# Altium schematic sheet Project_Information.SchDoc: =project_title
size Tabloid; CompanyName: Luxonis Holding; Organization: Luxonis Holding; Address1: 1925 Harmony Park Drive; Address2: Westminster, CO; Address3: 80234; Address4: United States; SheetNumber: 1; SheetTotal: 3
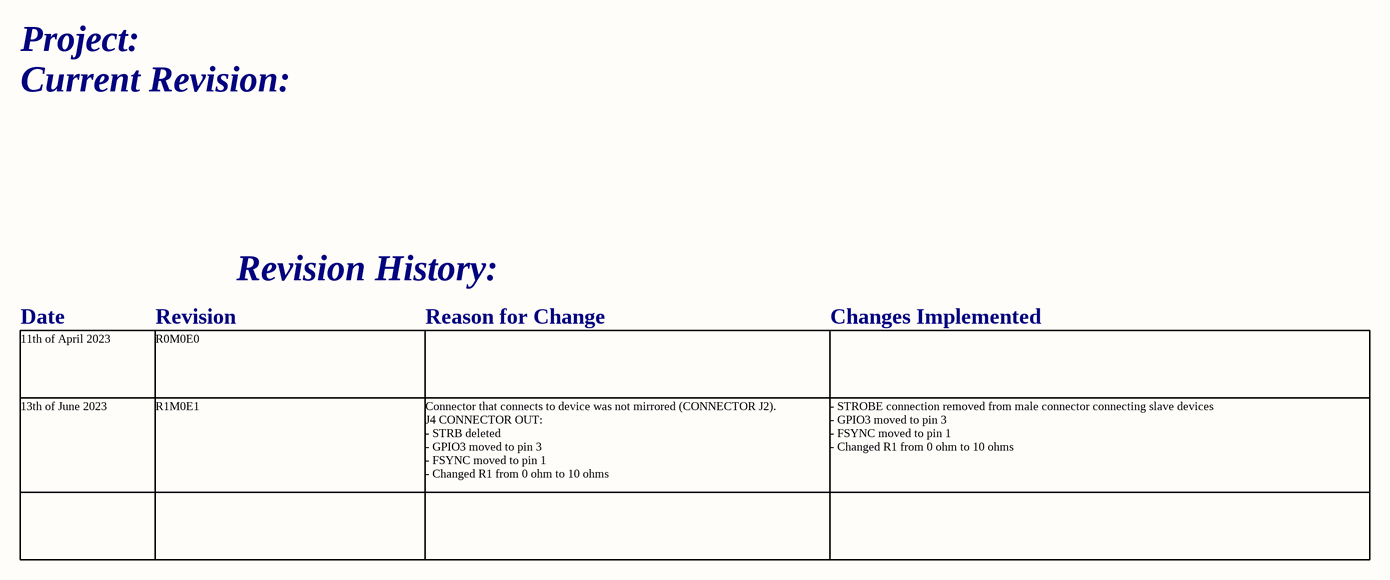
[diagram p0: Project_Information.SchDoc]

## Notes on the sheet
- Project:
- Current Revision:
- Revision History:
- Date
- Revision
- Reason for Change
- Changes Implemented
- 11th of April 2023
- R0M0E0
- 13th of June 2023
- R1M0E1
- Connector that connects to device was not mirrored (CONNECTOR J2).
  J4 CONNECTOR OUT:
  - STRB deleted
  - GPIO3 moved to pin 3
  - FSYNC moved to pin 1
  - Changed R1 from 0 ohm to 10 ohms
- - STROBE connection removed from male connector connecting slave devices
  - GPIO3 moved to pin 3
  - FSYNC moved to pin 1
  - Changed R1 from 0 ohm to 10 ohms
- Title
- Size:
- Date:
- Tabloid
- Number:
- Time:
- Revision:
- Sheet
- of
- Drawn by: